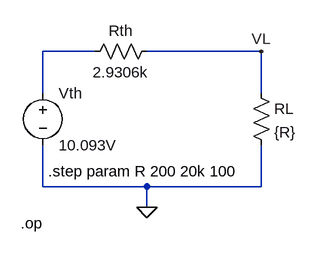
[diagram p0: schematic Task-3_22101008.asc.asc]
Task-3_22101008.asc.asc, the LTspice schematic file:
Version 4
SHEET 1 880 680
WIRE 144 80 64 80
WIRE 400 80 224 80
WIRE 64 144 64 80
WIRE 400 144 400 80
WIRE 64 288 64 224
WIRE 224 288 64 288
WIRE 400 288 400 224
WIRE 400 288 224 288
WIRE 224 320 224 288
FLAG 224 320 0
FLAG 400 80 VL
SYMBOL voltage 64 128 R0
SYMATTR InstName Vth
SYMATTR Value 10.093V
SYMBOL res 128 96 R270
WINDOW 0 32 56 VTop 2
WINDOW 3 0 56 VBottom 2
SYMATTR InstName Rth
SYMATTR Value 2.9306k
SYMBOL res 384 128 R0
SYMATTR InstName RL
SYMATTR Value {R}
TEXT 72 264 Left 2 !.step param R 200 20k 100
TEXT 30 344 Left 2 !.op

The netlist it stands for:
* Task-3_22101008.asc.asc
Vth N001 0 10.093V
Rth N001 VL 2.9306k
RL VL 0 {R}
.step param R 200 20k 100
.op
.backanno
.end